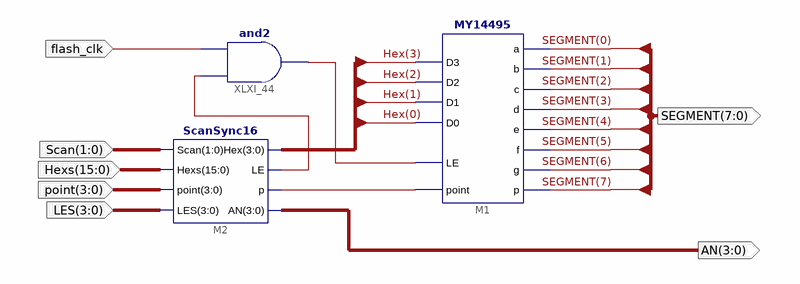
[diagram p0: schematic sheet 1]
// Xilinx ISE schematic Seg7_Dev16.sch (kintex7) as structural Verilog: 3 symbols, 7 ports
module Seg7_Dev16 (
  input  flash_clk,
  input  [1:0] Scan,
  input  [15:0] Hexs,
  input  [3:0] point,
  input  [3:0] LES,
  output [3:0] AN,
  output [7:0] SEGMENT
);

  wire XLXN_271, XLXN_382, XLXN_385;
  wire [3:0] Hex;

  and XLXI_44 (XLXN_385, XLXN_382, flash_clk);
  ScanSync16 M2 (.LES(LES), .AN(AN), .point(point), .p(XLXN_271), .Hex(Hex), .Hexs(Hexs), .Scan(Scan), .LE(XLXN_382));
  MY14495 M1 (
    .D0(Hex[0]), .D1(Hex[1]), .D2(Hex[2]), .D3(Hex[3]), .p(SEGMENT[7]), .g(SEGMENT[6]), .f(SEGMENT[5]),
    .e(SEGMENT[4]), .d(SEGMENT[3]), .c(SEGMENT[2]), .b(SEGMENT[1]), .a(SEGMENT[0]), .point(XLXN_271),
    .LE(XLXN_385));
endmodule
